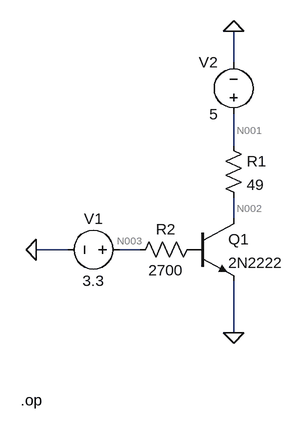
[diagram p0: schematic klucz_2.asc]
klucz_2.asc, the LTspice schematic file:
Version 4
SHEET 1 880 680
WIRE 80 -128 80 -176
WIRE 80 0 80 -48
WIRE 80 112 80 80
WIRE -176 160 -224 160
WIRE -64 160 -96 160
WIRE 80 288 80 208
FLAG -224 160 0
FLAG 80 -176 0
FLAG 80 288 0
SYMBOL voltage -80 160 R90
WINDOW 0 -32 56 VBottom 2
WINDOW 3 32 56 VTop 2
WINDOW 123 0 0 Left 0
WINDOW 39 0 0 Left 0
SYMATTR InstName V1
SYMATTR Value 3.3
SYMBOL npn 16 112 R0
SYMATTR InstName Q1
SYMATTR Value 2N2222
SYMBOL res 64 -16 R0
SYMATTR InstName R1
SYMATTR Value 49
SYMBOL voltage 80 -32 R180
WINDOW 0 24 96 Left 2
WINDOW 3 24 16 Left 2
WINDOW 123 0 0 Left 0
WINDOW 39 0 0 Left 0
SYMATTR InstName V2
SYMATTR Value 5
SYMBOL res 32 144 R90
WINDOW 0 0 56 VBottom 2
WINDOW 3 32 56 VTop 2
SYMATTR InstName R2
SYMATTR Value 2700
TEXT -248 392 Left 2 !.op

The netlist it stands for:
* klucz_2.asc
V1 N003 0 3.3
Q1 N002 P001 0 0 2N2222
R1 N001 N002 49
V2 N001 0 5
R2 P001 N003 2700
.model NPN NPN
.model PNP PNP
.lib standard.bjt
.op
.backanno
.end

* Results of the author's LTspice run, read from the files saved beside the schematic
* Operating Point:
*   V(n003) = 3.3 V
*   V(n002) = 182.6 mV
*   V(p001) = 810.7 mV
*   V(n001) = 5 V
*   Ic(Q1) = 98.32 mA
*   Ib(Q1) = 922 µA
*   Ie(Q1) = -99.24 mA
*   I(R2) = -922 µA
*   I(R1) = 98.32 mA
*   I(V2) = -98.32 mA
*   I(V1) = -922 µA
* From the log:
*   Semiconductor Device Operating Points:
*                           --- Bipolar Transistors ---
*   Name:       q1
*   Model:    2n2222
*   Ib:       9.22e-04
*   Ic:       9.83e-02
*   Vbe:      8.11e-01
*   Vbc:      6.28e-01
*   Vce:      1.83e-01
*   BetaDC:   1.07e+02
*   Gm:       3.05e+00
*   Rpi:      3.89e+01
*   Rx:       1.00e+01
*   Ro:       4.31e+01
*   Cbe:      1.47e-09
*   Cbc:      2.99e-09
*   Cjs:      0.00e+00
*   BetaAC:   1.19e+02
*   Cbx:      0.00e+00
*   Ft:       1.09e+08